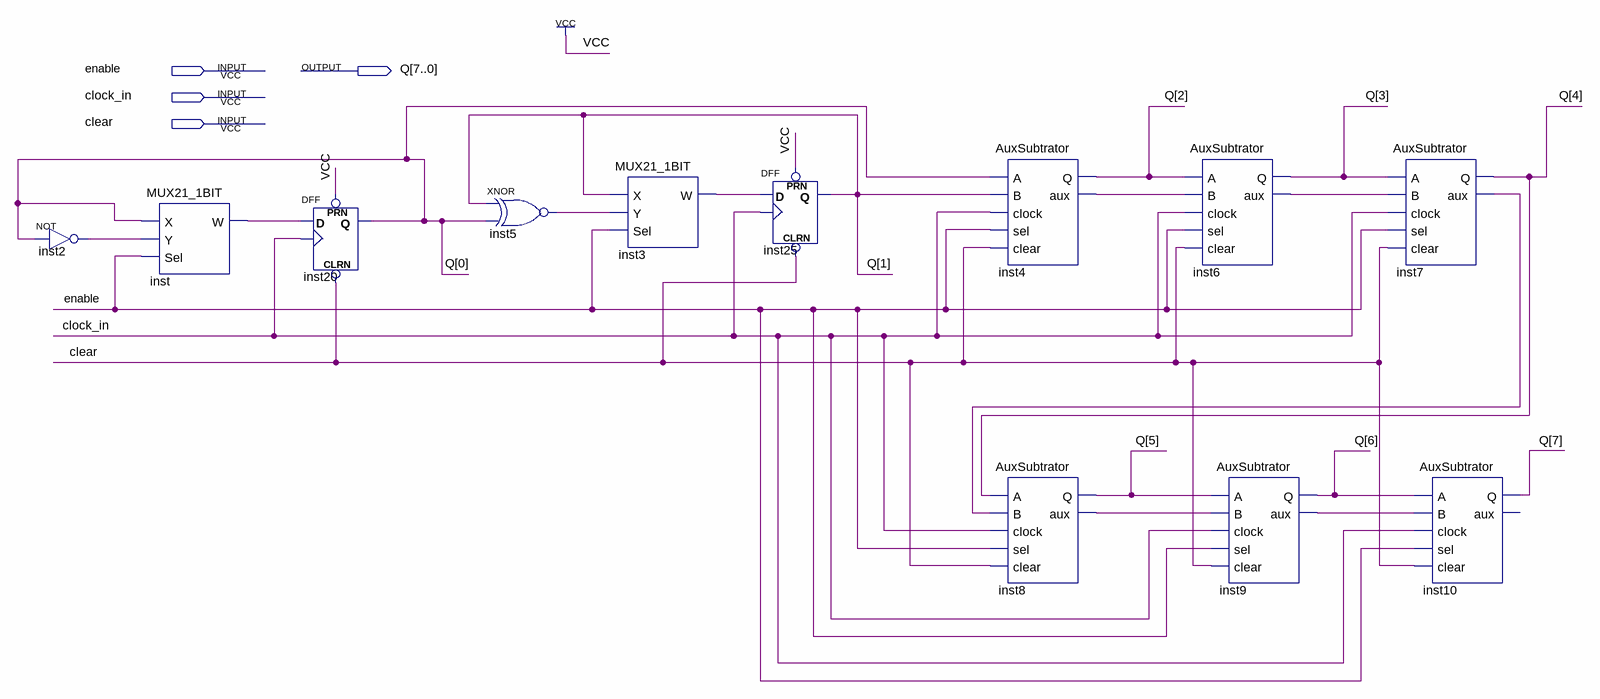
[diagram p0: schematic sheet]
// Quartus schematic Subtrator.bdf as structural Verilog: 12 symbols, 4 pins
module Subtrator (
  input  enable,
  input  clock_in,
  input  clear,
  output [7:0] Q
);

  wire inst2_out, inst3_w, inst4_aux, inst5_out, inst6_aux, inst7_aux, inst8_aux, inst9_aux, inst_w;

  not inst2 (inst2_out, Q[0]);
  MUX21_1BIT inst (.X(Q[0]), .Y(inst2_out), .Sel(enable), .W(inst_w));
  DFF inst20 (.CLRN(clear), .CLK(clock_in), .D(inst_w), .PRN(1'b1), .Q(Q[0]));
  xnor inst5 (inst5_out, Q[1], Q[0]);
  MUX21_1BIT inst3 (.X(Q[1]), .Y(inst5_out), .Sel(enable), .W(inst3_w));
  DFF inst25 (.CLRN(clear), .CLK(clock_in), .D(inst3_w), .PRN(1'b1), .Q(Q[1]));
  AuxSubtrator inst4 (.A(Q[0]), .B(Q[1]), .clock(clock_in), .sel(enable), .clear(clear), .Q(Q[2]), .aux(inst4_aux));
  AuxSubtrator inst8 (
    .A(Q[4]), .B(inst7_aux), .clock(clock_in), .sel(enable), .clear(clear), .Q(Q[5]), .aux(inst8_aux));
  AuxSubtrator inst6 (
    .A(Q[2]), .B(inst4_aux), .clock(clock_in), .sel(enable), .clear(clear), .Q(Q[3]), .aux(inst6_aux));
  AuxSubtrator inst9 (
    .A(Q[5]), .B(inst8_aux), .clock(clock_in), .sel(enable), .clear(clear), .Q(Q[6]), .aux(inst9_aux));
  AuxSubtrator inst7 (
    .A(Q[3]), .B(inst6_aux), .clock(clock_in), .sel(enable), .clear(clear), .Q(Q[4]), .aux(inst7_aux));
  AuxSubtrator inst10 (.A(Q[6]), .B(inst9_aux), .clock(clock_in), .sel(enable), .clear(clear), .Q(Q[7]));  // open: aux
endmodule
